# Altium schematic sheet 13.RK3588_Flash_SD Controller.SchDoc
size 297 x 209 mm; Revision: V2.1; Schematic Page Number: 11; Page Number: 13; Check: <Checker>; Schematic Name: RK_NVR_DEMO1_RK3588_LP4/4x_V21; Page Count: 43; Page name: 13.RK3588_Flash/SD Controller; Designer: Zhangdz; Schematic Page Count: 99; Revcode: V2.1; DsnPath: E:\Work\SBER\RK3588_SOM\temp\RK_NVR_DEMO1_RK3588_LP4XD200P232SD8_V21_20211228.DSN; SchematicName: RK_NVR_DEMO1_RK3588_LP4/4x_V21; PageName: 13.RK3588_Flash/SD Controller; PageSize: A4; TopSchematic: True
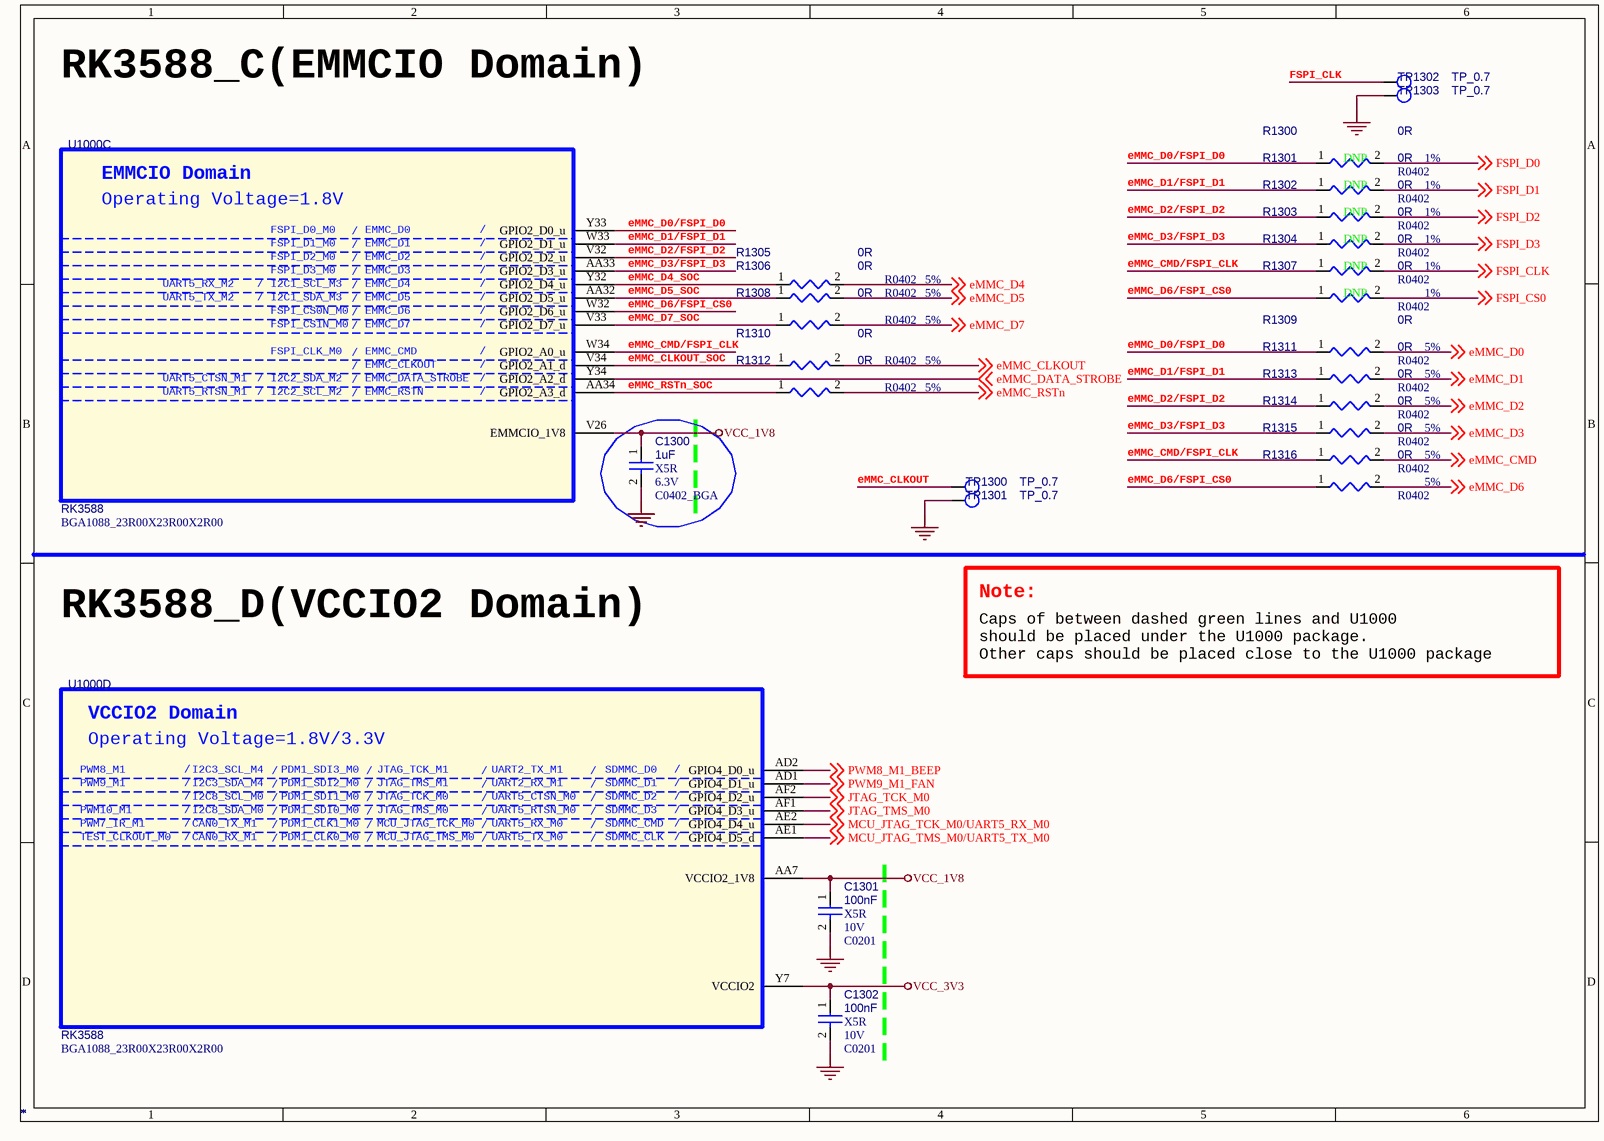
[diagram p0: 13.RK3588_Flash_SD Controller.SchDoc]

## Parts
C1300  *  Voltage: 6.3V  Dielectric: X5R  [C0402_BGA]
C1301  *  Voltage: 10V  Dielectric: X5R  [C0201]
C1302  *  Voltage: 10V  Dielectric: X5R  [C0201]
R1300  *  Tolerance: 1%  OPTION: DNP  [R0402]
R1301  *  Tolerance: 1%  OPTION: DNP  [R0402]
R1302  *  Tolerance: 1%  OPTION: DNP  [R0402]
R1303  *  Tolerance: 1%  OPTION: DNP  [R0402]
R1304  *  Tolerance: 1%  OPTION: DNP  [R0402]
R1305  *  Tolerance: 5%  [R0402]
R1306  *  Tolerance: 5%  [R0402]
R1307  *  Tolerance: 1%  OPTION: DNP  [R0402]
R1308  *  Tolerance: 5%  [R0402]
R1309  *  Tolerance: 5%  [R0402]
R1310  *  Tolerance: 5%  [R0402]
R1311  *  Tolerance: 5%  [R0402]
R1312  *  Tolerance: 5%  [R0402]
R1313  *  Tolerance: 5%  [R0402]
R1314  *  Tolerance: 5%  [R0402]
R1315  *  Tolerance: 5%  [R0402]
R1316  *  Tolerance: 5%  [R0402]
TP1300  *  [TEST]
TP1301  *  [TEST]
TP1302  *  [TEST]
TP1303  *  [TEST]
U1000  *  [BGA1088_23R00X23R00X2R00]  (parts C,D of 26)

## Nets
GND: C1300.2 C1301.2 C1302.2 TP1301.1 TP1303.1
VCC_1V8: C1300.1 C1301.1 U1000.AA7(VCCIO2_1V8) U1000.V26(EMMCIO_1V8)
VCC_3V3: C1302.1 U1000.Y7(VCCIO2)
eMMC_CLKOUT: R1310.2 TP1300.1 ; off-sheet eMMC_CLKOUT
eMMC_CLKOUT_SOC: R1310.1 U1000.V34(GPIO2_A1_d)
eMMC_CMD: R1315.2 ; off-sheet eMMC_CMD
eMMC_CMD/FSPI_CLK: R1304.1 R1315.1 U1000.W34(GPIO2_A0_u)
eMMC_D0: R1309.2 ; off-sheet eMMC_D0
eMMC_D0/FSPI_D0: R1300.1 R1309.1 U1000.Y33(GPIO2_D0_u)
eMMC_D1: R1311.2 ; off-sheet eMMC_D1
eMMC_D1/FSPI_D1: R1301.1 R1311.1 U1000.W33(GPIO2_D1_u)
eMMC_D2: R1313.2 ; off-sheet eMMC_D2
eMMC_D2/FSPI_D2: R1302.1 R1313.1 U1000.V32(GPIO2_D2_u)
eMMC_D3: R1314.2 ; off-sheet eMMC_D3
eMMC_D3/FSPI_D3: R1303.1 R1314.1 U1000.AA33(GPIO2_D3_u)
eMMC_D4: R1305.2 ; off-sheet eMMC_D4
eMMC_D4_SOC: R1305.1 U1000.Y32(GPIO2_D4_u)
eMMC_D5: R1306.2 ; off-sheet eMMC_D5
eMMC_D5_SOC: R1306.1 U1000.AA32(GPIO2_D5_u)
eMMC_D6: R1316.2 ; off-sheet eMMC_D6
eMMC_D6/FSPI_CS0: R1307.1 R1316.1 U1000.W32(GPIO2_D6_u)
eMMC_D7: R1308.2 ; off-sheet eMMC_D7
eMMC_D7_SOC: R1308.1 U1000.V33(GPIO2_D7_u)
eMMC_DATA_STROBE: U1000.Y34(GPIO2_A2_d) ; off-sheet eMMC_DATA_STROBE
eMMC_RSTn: R1312.2 ; off-sheet eMMC_RSTn
eMMC_RSTn_SOC: R1312.1 U1000.AA34(GPIO2_A3_d)
FSPI_CLK: R1304.2 TP1302.1 ; off-sheet FSPI_CLK
FSPI_CS0: R1307.2 ; off-sheet FSPI_CS0
FSPI_D0: R1300.2 ; off-sheet FSPI_D0
FSPI_D1: R1301.2 ; off-sheet FSPI_D1
FSPI_D2: R1302.2 ; off-sheet FSPI_D2
FSPI_D3: R1303.2 ; off-sheet FSPI_D3
JTAG_TCK_M0: U1000.AF2(GPIO4_D2_u) ; off-sheet JTAG_TCK_M0
JTAG_TMS_M0: U1000.AF1(GPIO4_D3_u) ; off-sheet JTAG_TMS_M0
MCU_JTAG_TCK_M0/UART5_RX_M0: U1000.AE2(GPIO4_D4_u) ; off-sheet MCU_JTAG_TCK_M0/UART5_RX_M0
MCU_JTAG_TMS_M0/UART5_TX_M0: U1000.AE1(GPIO4_D5_d) ; off-sheet MCU_JTAG_TMS_M0/UART5_TX_M0
PWM8_M1_BEEP: U1000.AD2(GPIO4_D0_u) ; off-sheet PWM8_M1_BEEP
PWM9_M1_FAN: U1000.AD1(GPIO4_D1_u) ; off-sheet PWM9_M1_FAN

## Notes on the sheet
- RK3588_C(EMMCIO Domain)
- Note:
- RK3588_D(VCCIO2 Domain)
- Caps of between dashed green lines and U1000
  should be placed under the U1000 package.
  Other caps should be placed close to the U1000 package
- (in symbol SOC_RK3588, part C) EMMCIO Domain; Operating Voltage=1.8V; FSPI_D0_M0; /; EMMC_D0; FSPI_D1_M0; EMMC_D1; FSPI_D2_M0; EMMC_D2; FSPI_D3_M0; EMMC_D3; UART5_RX_M2; I2C1_SCL_M3; EMMC_D4; UART5_TX_M2; I2C1_SDA_M3; EMMC_D5; FSPI_CS0N_M0; EMMC_D6; FSPI_CS1N_M0; EMMC_D7; FSPI_CLK_M0; EMMC_CMD; EMMC_CLKOUT; UART5_CTSN_M1; I2C2_SDA_M2; EMMC_DATA_STROBE; UART5_RTSN_M1; I2C2_SCL_M2; EMMC_RSTN
- (in symbol SOC_RK3588, part D) VCCIO2 Domain; Operating Voltage=1.8V/3.3V; PWM8_M1; /; I2C3_SCL_M4; PDM1_SDI3_M0; JTAG_TCK_M1; UART2_TX_M1; SDMMC_D0; PWM9_M1; I2C3_SDA_M4; PDM1_SDI2_M0; JTAG_TMS_M1; UART2_RX_M1; SDMMC_D1; I2C8_SCL_M0; PDM1_SDI1_M0; JTAG_TCK_M0; UART5_CTSN_M0; SDMMC_D2; PWM10_M1; I2C8_SDA_M0; PDM1_SDI0_M0; JTAG_TMS_M0; UART5_RTSN_M0; SDMMC_D3; PWM7_IR_M1; CAN0_TX_M1; PDM1_CLK1_M0; MCU_JTAG_TCK_M0; UART5_RX_M0; SDMMC_CMD; TEST_CLKOUT_M0; CAN0_RX_M1; PDM1_CLK0_M0; MCU_JTAG_TMS_M0; UART5_TX_M0; SDMMC_CLK

## Library data of the parts
C1300 = CAP NP: cap,1.00uF,+/-10%,6.3V,X5R,C0402; Part Reference: C1300; Manufacturer PN: C1005X5R0J105K050BB; Manufacturer: TDK; Value: 1uF; Tolerance: 10%; Priority: A; PCB Footprint: C0402_BGA; Created by: JJJ; Part Type: C0402; RK PN: C1005X5R0J105K050BB
C1301 = CAP NP: cap,100.00nF,+/-10%,10V,X5R,C0201; Part Reference: C1301; Manufacturer PN: C0603X5R1A104K030BC; Manufacturer: TDK; Value: 100nF; Tolerance: 10%; Priority: A; PCB Footprint: C0201; Created by: JJJ; Part Type: C0201; RK PN: C0603X5R1A104K030BC
C1302 = CAP NP: cap,100.00nF,+/-10%,10V,X5R,C0201; Part Reference: C1302; Manufacturer PN: C0603X5R1A104K030BC; Manufacturer: TDK; Value: 100nF; Tolerance: 10%; Priority: A; PCB Footprint: C0201; Created by: JJJ; Part Type: C0201; RK PN: C0603X5R1A104K030BC
R1300 = RESISTOR_Dup1: НЁУГєсД¤µзЧи,0R,+/-1%,R0402,1/16W.; Part Reference: R1300; Manufacturer: YAGEO; RK PN: RC0402FR-070RL; Priority: A; Wattage: 1/16W; PCB Footprint: R0402; Value: 0R; Part Type: НЁУГєсД¤µзЧи; Manufacturer PN: RC0402FR-070RL; Created by: YTL
R1301 = RESISTOR_Dup1: НЁУГєсД¤µзЧи,0R,+/-1%,R0402,1/16W.; Part Reference: R1301; Manufacturer: YAGEO; RK PN: RC0402FR-070RL; Priority: A; Wattage: 1/16W; PCB Footprint: R0402; Value: 0R; Part Type: НЁУГєсД¤µзЧи; Manufacturer PN: RC0402FR-070RL; Created by: YTL
R1302 = RESISTOR_Dup1: НЁУГєсД¤µзЧи,0R,+/-1%,R0402,1/16W.; Part Reference: R1302; Manufacturer: YAGEO; RK PN: RC0402FR-070RL; Priority: A; Wattage: 1/16W; PCB Footprint: R0402; Value: 0R; Part Type: НЁУГєсД¤µзЧи; Manufacturer PN: RC0402FR-070RL; Created by: YTL
R1303 = RESISTOR_Dup1: НЁУГєсД¤µзЧи,0R,+/-1%,R0402,1/16W.; Part Reference: R1303; Manufacturer: YAGEO; RK PN: RC0402FR-070RL; Priority: A; Wattage: 1/16W; PCB Footprint: R0402; Value: 0R; Part Type: НЁУГєсД¤µзЧи; Manufacturer PN: RC0402FR-070RL; Created by: YTL
R1304 = RESISTOR_Dup1: НЁУГєсД¤µзЧи,0R,+/-1%,R0402,1/16W.; Part Reference: R1304; Manufacturer: YAGEO; RK PN: RC0402FR-070RL; Priority: A; Wattage: 1/16W; PCB Footprint: R0402; Value: 0R; Part Type: НЁУГєсД¤µзЧи; Manufacturer PN: RC0402FR-070RL; Created by: YTL
R1305 = RESISTOR_Dup1: НЁУГєсД¤µзЧи,0R,+/-5%,R0402,1/16W.; Part Reference: R1305; Manufacturer PN: RC0402JR-070RL; Manufacturer: YAGEO; Wattage: 1/16W; Priority: A; PCB Footprint: R0402; Value: 0R; Created by: YTL; Part Type: НЁУГєсД¤µзЧи; RK PN: RC0402JR-070RL
R1306 = RESISTOR_Dup1: НЁУГєсД¤µзЧи,0R,+/-5%,R0402,1/16W.; Part Reference: R1306; Manufacturer: YAGEO; RK PN: RC0402JR-070RL; Priority: A; Wattage: 1/16W; PCB Footprint: R0402; Value: 0R; Part Type: НЁУГєсД¤µзЧи; Manufacturer PN: RC0402JR-070RL; Created by: YTL
R1307 = RESISTOR_Dup1: НЁУГєсД¤µзЧи,0R,+/-1%,R0402,1/16W.; Part Reference: R1307; Manufacturer: YAGEO; RK PN: RC0402FR-070RL; Priority: A; Wattage: 1/16W; PCB Footprint: R0402; Value: 0R; Part Type: НЁУГєсД¤µзЧи; Manufacturer PN: RC0402FR-070RL; Created by: YTL
R1308 = RESISTOR_Dup1: НЁУГєсД¤µзЧи,0R,+/-5%,R0402,1/16W.; Part Reference: R1308; Manufacturer PN: RC0402JR-070RL; Manufacturer: YAGEO; Wattage: 1/16W; Priority: A; PCB Footprint: R0402; Value: 0R; Created by: YTL; Part Type: НЁУГєсД¤µзЧи; RK PN: RC0402JR-070RL
R1309 = RESISTOR_Dup1: НЁУГєсД¤µзЧи,0R,+/-5%,R0402,1/16W.; Part Reference: R1309; Manufacturer PN: RC0402JR-070RL; Manufacturer: YAGEO; Wattage: 1/16W; Priority: A; PCB Footprint: R0402; Value: 0R; Created by: YTL; Part Type: НЁУГєсД¤µзЧи; RK PN: RC0402JR-070RL
R1310 = RESISTOR_Dup1: НЁУГєсД¤µзЧи,0R,+/-5%,R0402,1/16W.; Part Reference: R1310; Manufacturer: YAGEO; RK PN: RC0402JR-070RL; Priority: A; Wattage: 1/16W; PCB Footprint: R0402; Value: 0R; Part Type: НЁУГєсД¤µзЧи; Manufacturer PN: RC0402JR-070RL; Created by: YTL
R1311 = RESISTOR_Dup1: НЁУГєсД¤µзЧи,0R,+/-5%,R0402,1/16W.; Part Reference: R1311; Manufacturer PN: RC0402JR-070RL; Manufacturer: YAGEO; Wattage: 1/16W; Priority: A; PCB Footprint: R0402; Value: 0R; Created by: YTL; Part Type: НЁУГєсД¤µзЧи; RK PN: RC0402JR-070RL
R1312 = RESISTOR_Dup1: НЁУГєсД¤µзЧи,0R,+/-5%,R0402,1/16W.; Part Reference: R1312; Manufacturer: YAGEO; RK PN: RC0402JR-070RL; Priority: A; Wattage: 1/16W; PCB Footprint: R0402; Value: 0R; Part Type: НЁУГєсД¤µзЧи; Manufacturer PN: RC0402JR-070RL; Created by: YTL
R1313 = RESISTOR_Dup1: НЁУГєсД¤µзЧи,0R,+/-5%,R0402,1/16W.; Part Reference: R1313; Manufacturer PN: RC0402JR-070RL; Manufacturer: YAGEO; Wattage: 1/16W; Priority: A; PCB Footprint: R0402; Value: 0R; Created by: YTL; Part Type: НЁУГєсД¤µзЧи; RK PN: RC0402JR-070RL
R1314 = RESISTOR_Dup1: НЁУГєсД¤µзЧи,0R,+/-5%,R0402,1/16W.; Part Reference: R1314; Manufacturer PN: RC0402JR-070RL; Manufacturer: YAGEO; Wattage: 1/16W; Priority: A; PCB Footprint: R0402; Value: 0R; Created by: YTL; Part Type: НЁУГєсД¤µзЧи; RK PN: RC0402JR-070RL
R1315 = RESISTOR_Dup1: НЁУГєсД¤µзЧи,0R,+/-5%,R0402,1/16W.; Part Reference: R1315; Manufacturer PN: RC0402JR-070RL; Manufacturer: YAGEO; Wattage: 1/16W; Priority: A; PCB Footprint: R0402; Value: 0R; Created by: YTL; Part Type: НЁУГєсД¤µзЧи; RK PN: RC0402JR-070RL
R1316 = RESISTOR_Dup1: НЁУГєсД¤µзЧи,0R,+/-5%,R0402,1/16W.; Part Reference: R1316; Manufacturer PN: RC0402JR-070RL; Manufacturer: YAGEO; Wattage: 1/16W; Priority: A; PCB Footprint: R0402; Value: 0R; Created by: YTL; Part Type: НЁУГєсД¤µзЧи; RK PN: RC0402JR-070RL
TP1300 = TP: Test Point 0.7mm; Part Reference: TP1300; PCB Footprint: TP_0R70; Value: TP_0.7; RK PN: TESTPOINT_0R7; Priority: A; Part Type: TP; Created by: JJJ
TP1301 = TP: Test Point 0.7mm; Part Reference: TP1301; PCB Footprint: TP_0R70; Value: TP_0.7; RK PN: TESTPOINT_0R7; Priority: A; Part Type: TP; Created by: JJJ
TP1302 = TP: Test Point 0.7mm; Part Reference: TP1302; PCB Footprint: TP_0R70; Value: TP_0.7; Priority: A; RK PN: TESTPOINT_0R7; Created by: JJJ; Part Type: TP
TP1303 = TP: Test Point 0.7mm; Part Reference: TP1303; PCB Footprint: TP_0R70; Value: TP_0.7; RK PN: TESTPOINT_0R7; Priority: A; Part Type: TP; Created by: JJJ
U1000 = SOC_RK3588: ROCKCHIP SOC; Part Reference: U1000; Manufacturer: Rockchip (ИрРѕОў); SPLIT_INST: TRUE; SWAP_INFO: (S1+S2+S3+S4+S5+S6+S7+S8+S9+S10+S11+S12+S13+S14+S15+S16+S17+S18+S19+S20+S21+S22+S23+S24+S25+S26); Value: RK3588; Priority: A; RK PN: RK3588; Part Type: SOC; Manufacturer PN: RK3588; Created by: YWQ; PCB Footprint: BGA1088_23R00X23R00X2R00